# EAGLE design FreshBytes (EAGLE 9.1.0)
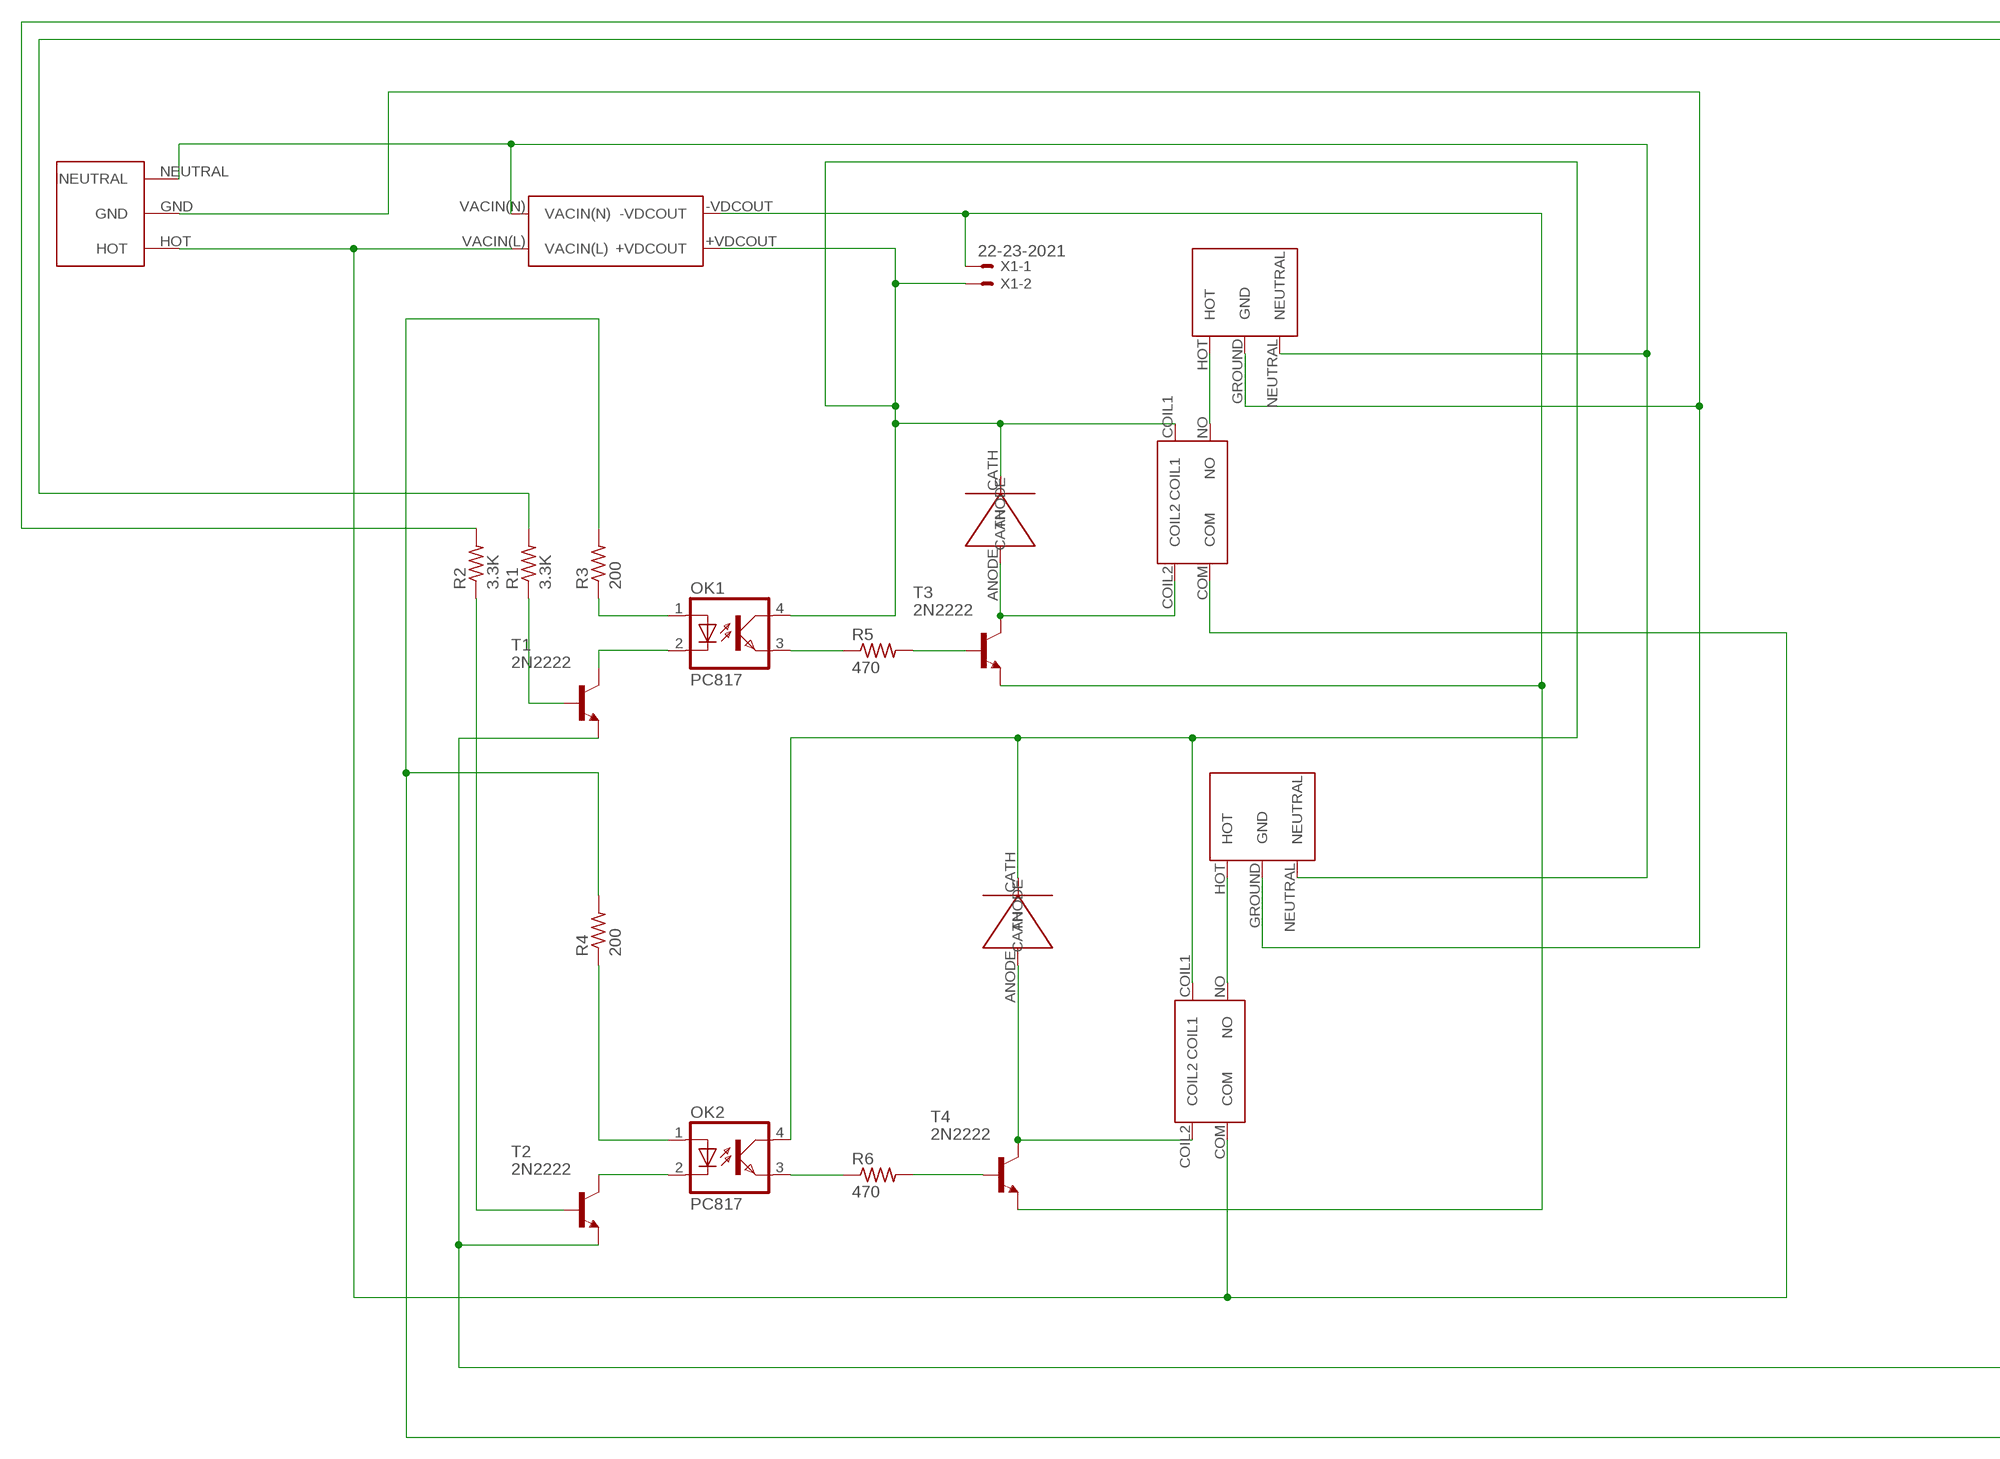
[diagram p0: schematic, sheet 1, part 1 of 2]
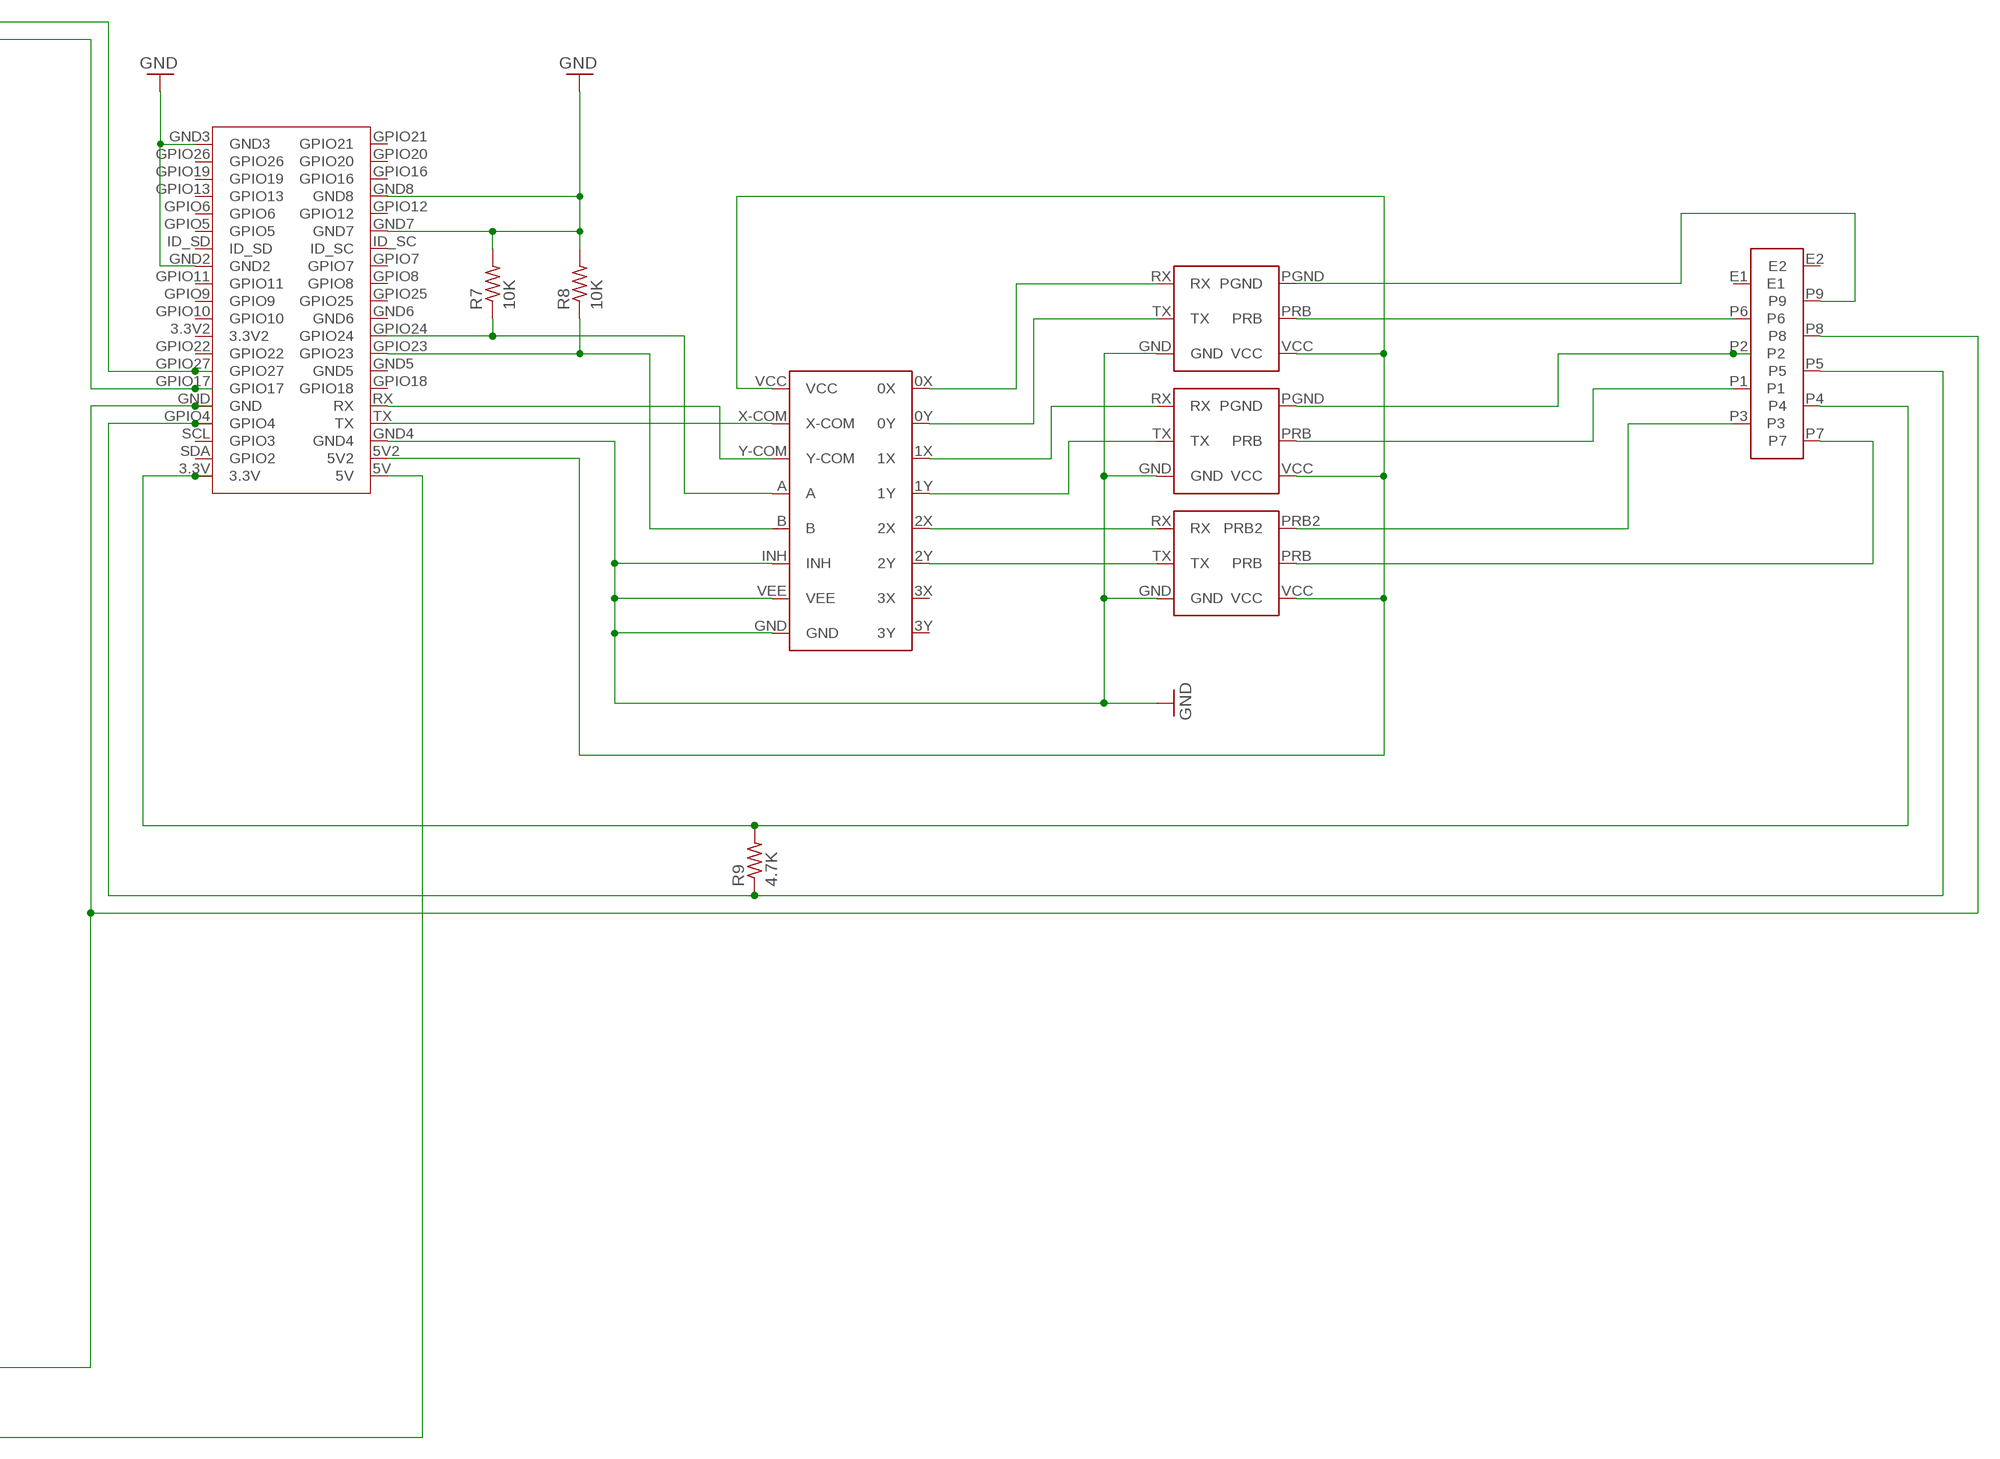
[diagram p1: schematic, sheet 1, part 2 of 2]

## Parts
MUX  7HC4052_MUX  [SSOP16]
OK1  PC817  [DIL04]
OK2  PC817  [DIL04]
R1  3.3K  R-US_R0805  [R0805]
R2  3.3K  R-US_R0805  [R0805]
R3  200  R-US_R0805  [R0805]
R4  200  R-US_R0805  [R0805]
R5  470  R-US_R0805  [R0805]
R6  470  R-US_R0805  [R0805]
R7  10K  R-US_R0805  [R0805]
R8  10K  R-US_R0805  [R0805]
R9  4.7K  R-US_R0805  [R0805]
T1  2N2222  [TO92-EBC-OVAL]
T2  2N2222  [TO92-EBC-OVAL]
T3  2N2222  [TO92-EBC-OVAL]
T4  2N2222  [TO92-EBC-OVAL]
U$1  POWER_IN  [POWER_IN]
U$2  VTB8441BH  [VTB8441BH]
U$3  VTB8441BH  [VTB8441BH]
U$4  9POS_MINI_DIN  [9POS_MINI_DIN]
U$5  ATLAS_DO_WITH_ICON  [ATLAS_DO_WITH_ICON]
U$6  IEC_FEMALE  [IEC_FEMALE]
U$7  IEC_FEMALE  [IEC_FEMALE]
U$8  ATLAS_PH_WITH_ICON  [ATLAS_PH_WITH_ICON]
U$9  ATLAS_PPM_WITH_ICON  [ATLAS_PPM_WITH_ICON]
U$10  RPI_ZERO  [RPI_ZERO]
U$11  RELAY  [RELAY]
U$12  RELAY  [RELAY]
U$17  RAC02-05SC_ACDCCONVERTER  [RAC02-05SC_ACDCCONVERTER]
X1  22-23-2021  [22-23-2021]

## Nets
AGND: T3.E T4.E U$17.-VDCOUT X1.1
DGND: T1.E T2.E U$4.P8 U$10.GND
GND: MUX.GND MUX.INH MUX.VEE R7.2 R8.2 U$5.GND U$8.GND U$9.GND U$10.GND2 U$10.GND3 U$10.GND4 U$10.GND7 U$10.GND8
N$1: R2.2 U$10.GPIO27
N$3: R1.1 T1.B
N$4: OK1.1(A) R3.1
N$5: OK1.2(C) T1.C
N$7: MUX.X-COM U$10.TX
N$8: R2.1 T2.B
N$9 [Power]: U$6.HOT U$11.NO
N$10: OK2.1(A) R4.1
N$11: OK2.2(C) T2.C
N$12: OK2.3(EMIT) R6.1
N$13: OK1.3(EMIT) R5.1
N$14: R5.2 T3.B
N$15: R6.2 T4.B
N$16: T4.C U$3.ANODE U$12.COIL2
N$17 [Power]: U$7.HOT U$12.NO
N$18: T3.C U$2.ANODE U$11.COIL2
N$19 [Power]: U$1.HOT U$11.COM U$12.COM U$17.VACIN(L)
N$20 [Power]: U$1.NEUTRAL U$6.NEUTRAL U$7.NEUTRAL U$17.VACIN(N)
N$21: MUX.Y-COM U$10.RX
N$22: MUX.2Y U$9.TX
N$23: MUX.2X U$9.RX
N$24: MUX.1Y U$8.TX
N$25: MUX.1X U$8.RX
N$26: MUX.0Y U$5.TX
N$27: MUX.0X U$5.RX
N$29: MUX.A R7.1 U$10.GPIO24
N$31: U$4.P9 U$5.PGND
N$32: OK1.4(COL) OK2.4(COL) U$2.CATH U$3.CATH U$11.COIL1 U$12.COIL1 U$17.+VDCOUT X1.2
N$33: MUX.VCC U$5.VCC U$8.VCC U$9.VCC U$10.5V2
N$35: R1.2 U$10.GPIO17
N$36: R9.2 U$4.P4 U$10.3.3V
N$37: U$4.P7 U$9.PRB
N$38: U$4.P3 U$9.PRB2
N$39: U$4.P1 U$8.PRB
N$40: U$4.P2 U$8.PGND
N$41: U$4.P6 U$5.PRB
N$42: R9.1 U$4.P5 U$10.GPIO4
N$43: MUX.B R8.1 U$10.GPIO23
N$44: R3.2 R4.2 U$10.5V
PGND [Power]: U$1.GND U$6.GROUND(GND) U$7.GROUND(GND)
Unconnected: MUX.3X MUX.3Y U$4.E1 U$4.E2 U$10.GND6 U$10.GPIO5 U$10.GPIO6 U$10.GPIO7 U$10.GPIO8 U$10.GPIO9 U$10.GPIO10 U$10.GPIO11 U$10.GPIO12 U$10.GPIO13 U$10.GPIO16 U$10.GPIO18 U$10.GPIO19 U$10.GPIO20 U$10.GPIO21 U$10.GPIO22 U$10.GPIO25 U$10.GPIO26 U$10.ID_SC U$10.ID_SD U$10.SCL(GPIO3) U$10.SDA(GPIO2)

## Power pins joined to a net without a drawn wire
3.3V2: U$10.3.3V2
GND5: U$10.GND5

## Library data of the parts
MUX = BloomWall:7HC4052_MUX
OK1 OK2 = optocoupler:PC817: SHARP OPTO COUPLER; MPN: PC817X4J000F; OC_FARNELL: 9707727; OC_NEWARK: 97K7059
R1-R6 = resistor:R-US_: RESISTOR, American symbol
R7-R9 = adafruit:R-US_: RESISTOR, American symbol
T1-T4 = adafruit:2N2222: NPN TRANSISTOR Big oval pads
U$1 = FreshBytes:POWER_IN
U$2 U$3 = BloomWall:VTB8441BH
U$4 = BloomWall:9POS_MINI_DIN
U$5 = BloomWall:ATLAS_DO_WITH_ICON
U$6 U$7 = BloomWall:IEC_FEMALE
U$8 = BloomWall:ATLAS_PH_WITH_ICON
U$9 = BloomWall:ATLAS_PPM_WITH_ICON
U$10 = FreshBytes:RPI_ZERO
U$11 U$12 = FreshBytes:RELAY
U$17 = BloomWall:RAC02-05SC_ACDCCONVERTER
X1 = con-molex:22-23-2021: .100" (2.54mm) Center Header - 2 Pin; MF: MOLEX; MPN: 22-23-2021; OC_FARNELL: 1462926; OC_NEWARK: 25C3832

## Net classes
0 default: width 0.305 mm, drill 0.508 mm, clearance 0.203 mm
1 Power: width 5.715 mm, drill 5.715 mm, clearance 0.508 mm

## Board
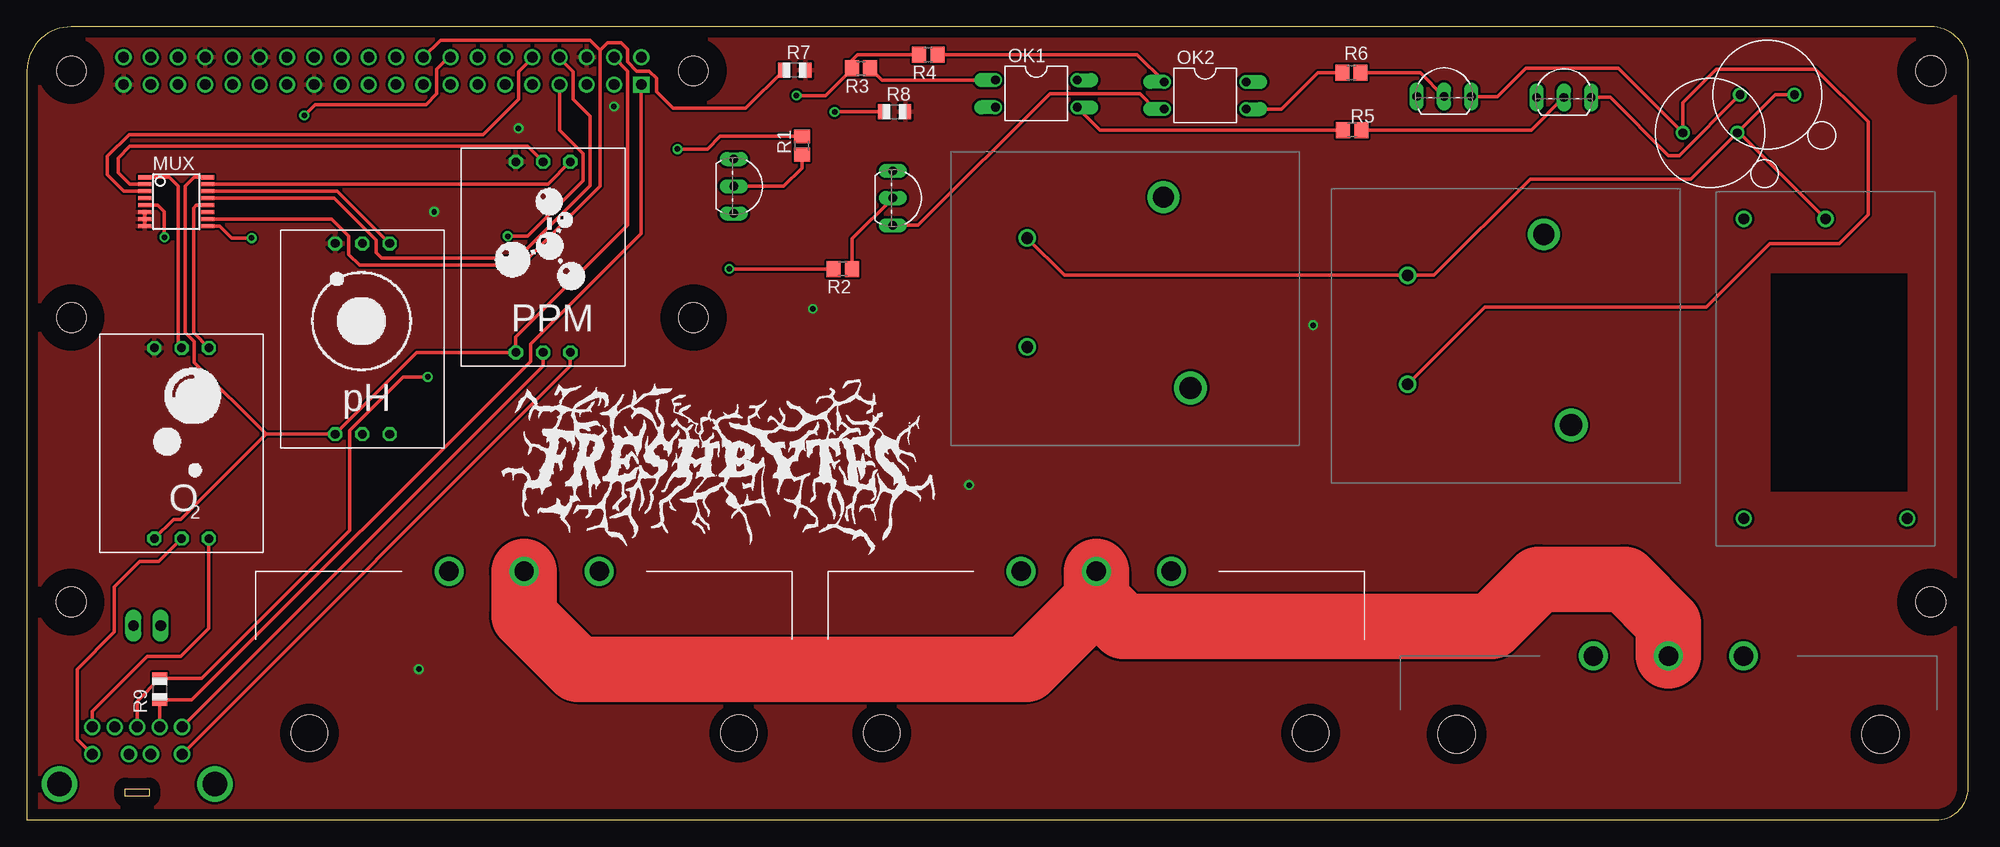
[diagram p2: board, top side]
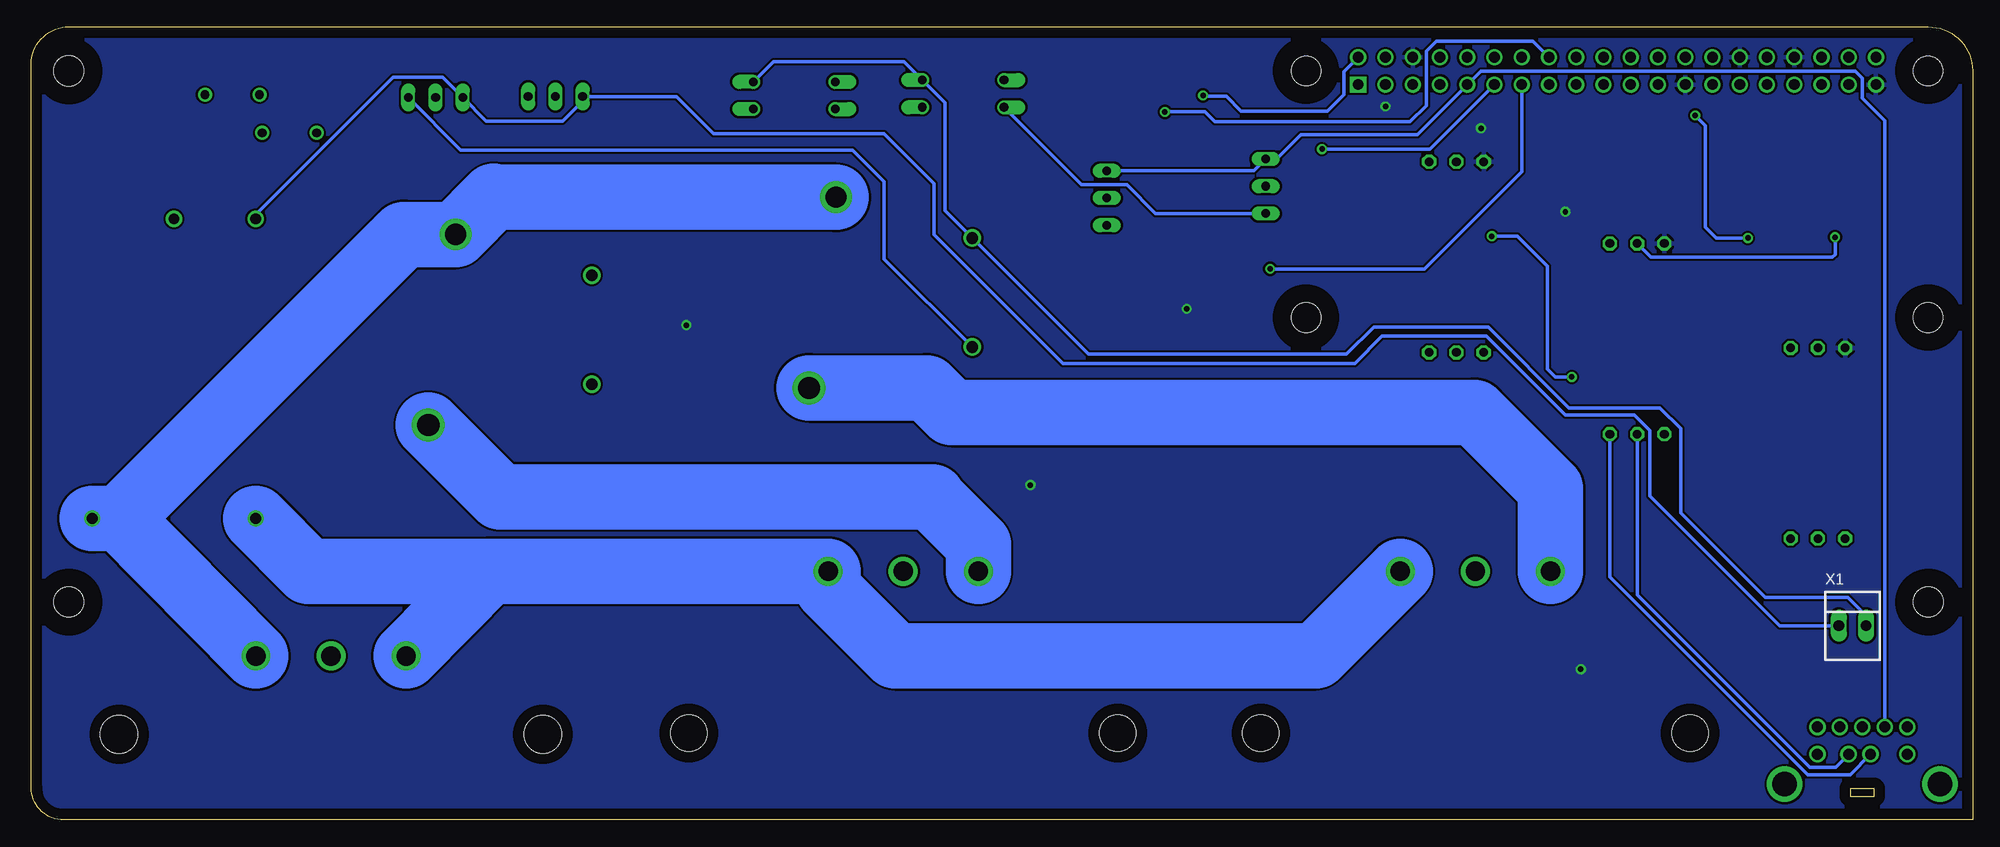
[diagram p3: board, bottom side, seen from below]

Size 180.97 x 73.96 mm. Coordinates in mm from the lower left corner, seen from the top.
Outline: 0,0 177.97,0 arc90 180.97,3 180.97,70.48 arc90 177.47,73.97 4.14,73.97 arc90 0,69.85 0,0
Copper layers (1*16): Top 0.035mm / dielectric 1.5mm / Bottom 0.035mm
Design rules "default *": minimum track width 10mil, minimum drill 12mil, track to track 8mil, track to pad 8mil, pad to pad 8mil, via to via 8mil, smd to smd 8mil, copper to edge 40mil, drill to drill 8mil, minimum pad ring 10mil, minimum via ring 8mil, stop-mask expansion 4mil, vias tented up to drill 0mil, thermal gap 10mil
Holes 2.8 mm at 4.13,20.32 177.48,69.85 177.48,20.32
tRestrict: area 175.9,18.8 to 179,21.9; area 175.9,68.3 to 179,71.4; area 2.6,18.8 to 5.7,21.9
bRestrict: area 2.6,18.8 to 5.7,21.9; area 175.9,68.3 to 179,71.4; area 175.9,18.8 to 179,21.9

### Footprints (pad centres in the part's own frame; a part is rotated, then mirrored left to right if it is on the bottom)
SSOP16 = smd 0.4 x 1.2: 0X 0.325,2.925; 0Y -2.275,-2.925; 1X -0.975,2.925; 1Y 0.325,-2.925; 2X -1.625,2.925; 2Y -1.625,-2.925; 3X 0.975,2.925; 3Y -0.325,-2.925; A 1.625,2.925; B 2.275,2.925; GND 2.275,-2.925; INH 0.975,-2.925; VCC -2.275,2.925; VEE 1.625,-2.925; X-COM -0.325,2.925; Y-COM -0.975,-2.925
DIL04 = drill 0.813 offset: 1 -1.27,-3.81; 2 1.27,-3.81; 3 1.27,3.81; 4 -1.27,3.81
R0805 = smd 1.3 x 1.5: 1 -0.85,0; 2 0.85,0
R0805' = smd 1.1 x 1.4: 1 -1,0; 2 1,0
TO92-EBC-OVAL = drill 0.813 long: B 0,-1.27; C 2.54,-1.27; E -2.54,-1.27
POWER_IN = drill 1.8: GND 0,0; HOT 7,0; NEUTRAL -7,0 | hole 3.5: -19.75,-7.3; 19.75,-7.3
VTB8441BH = drill 0.8: ANODE 2.54,0; CATH -2.54,0
9POS_MINI_DIN = drill 2.286: E1 -7.239,-5.588; E2 7.239,-5.588 | drill 1.016: P1 -1.27,-8.382; P2 0.762,-8.382; P3 -4.191,-8.382; P4 -2.095,-10.922; P5 0,-10.922; P6 4.191,-8.382; P7 -4.191,-10.922; P8 2.095,-10.922; P9 4.191,-10.922
ATLAS_DO_WITH_ICON = drill 0.8 octagon: GND -2.54,8.89; PGND 2.54,-8.89; PRB 0,-8.89; RX 2.54,8.89; TX 0,8.89; VCC -2.54,-8.89
IEC_FEMALE = drill 1.803: GROUND 0,0; HOT -7,0; NEUTRAL 7,0 | hole 3.404: -20,-15.1; 20,-15.1
ATLAS_PH_WITH_ICON = drill 0.8 octagon: GND -2.54,8.89; PGND 2.54,-8.89; PRB 0,-8.89; RX 2.54,8.89; TX 0,8.89; VCC -2.54,-8.89
ATLAS_PPM_WITH_ICON = drill 0.8 octagon: GND -2.54,8.89; PRB 0,-8.89; PRB2 2.54,-8.89; RX 2.54,8.89; TX 0,8.89; VCC -2.54,-8.89
RPI_ZERO = drill 1 square: 3.3V 24.13,-1.27 | drill 1: 3.3V2 3.81,-1.27; 5V 24.13,1.27; 5V2 21.59,1.27; GND 13.97,-1.27; GND2 -6.35,-1.27; GND3 -24.13,-1.27; GND4 19.05,1.27; GND5 8.89,1.27; GND6 1.27,1.27; GND7 -11.43,1.27; GND8 -16.51,1.27; GPIO4 16.51,-1.27; GPIO5 -11.43,-1.27; GPIO6 -13.97,-1.27; GPIO7 -6.35,1.27; GPIO8 -3.81,1.27; GPIO9 -1.27,-1.27; GPIO10 1.27,-1.27; GPIO11 -3.81,-1.27; GPIO12 -13.97,1.27; GPIO13 -16.51,-1.27; GPIO16 -19.05,1.27; GPIO17 11.43,-1.27; GPIO18 11.43,1.27; GPIO19 -19.05,-1.27; GPIO20 -21.59,1.27; GPIO21 -24.13,1.27; GPIO22 6.35,-1.27; GPIO23 6.35,1.27; GPIO24 3.81,1.27; GPIO25 -1.27,1.27; GPIO26 -21.59,-1.27; GPIO27 8.89,-1.27; ID_SC -8.89,1.27; ID_SD -8.89,-1.27; RX 13.97,1.27; SCL 19.05,-1.27; SDA 21.59,-1.27; TX 16.51,1.27 | hole 2.75: -29,0; -29,-23; 29,0; 29,-23
RELAY = drill 1.092: COIL1 -13.97,-15.24; COIL2 -3.81,-15.24 | drill 1.981: COM -17.78,-2.54 | drill 2.057: NO 0,0
RAC02-05SC_ACDCCONVERTER = drill 1: +VDCOUT 0,0; -VDCOUT 0,7.62; VACIN(L) -27.94,-7.62; VACIN(N) -27.94,7.62
22-23-2021 = drill 1 long: 1 -1.27,0; 2 1.27,0

### Placement (x,y rotation side)
MUX  13.93,57.66 270 top
OK1  94.1,67.74 270 top
OK2  109.85,67.56 270 top
R1  72.25,62.89 90 top
R2  76.07,51.38 180 top
R3  77.77,70.09 180 top
R4  84.03,71.36 180 top
R5  123.56,64.33 0 top
R6  123.48,69.68 0 top
R7  10K  [R0805']  71.58,69.94 0 top
R8  10K  [R0805']  80.89,66.04 0 top
R9  4.7K  [R0805']  12.4,12.19 270 top
T1  67.18,59.1 270 top
T2  82,58 270 top
T3  143.29,68.65 0 top
T4  132.12,68.73 0 top
U$1  153.03,15.29 0 top
U$2  162.25,67.63 180 top
U$3  156.91,64.08 180 top
U$4  10.29,-2.25 180 top
U$5  14.43,35.13 0 top
U$6  46.35,23.2 0 top
U$7  99.7,23.2 0 top
U$8  31.28,44.87 0 top
U$9  48.13,52.49 0 top
U$10  33.15,69.85 0 top
U$11  108.49,40.3 270 top
U$12  143.96,36.83 270 top
U$17  167.68,56.05 90 top
X1  11.21,18.12 0 bottom

### Tracks (layer width: path | path; a pad name or v marks a point on that pad's centre or on a via)
AGND
  Bottom 0.305: X1.1 17.99,18.12 30.1,30.22 30.1,36.32 31.54,37.76 37.97,37.76 45.34,45.12 55.07,45.12 57.61,42.58 84.79,42.58 96.81,54.6 96.81,59.34 101.46,64 105.95,64 | 105.95,64 117.38,64 120.84,67.46 T4.E 129.58,67.04 131.43,65.19 138.56,65.19 T3.E 142.62,69.25 147.26,69.25 160.06,56.46 U$17.-VDCOUT | 105.95,64 | 105.95,64
DGND
  Bottom 0.305: U$4.P8 8.19,65.21 10.29,67.3 10.29,69.17 10.96,69.84 45.85,69.84 U$10.GND 51.78,63.92 62.6,63.92 64.88,61.64 T1.E 67.01,60.54 T2.E
GND  (via drill 0.51)
  Top 0.305: MUX.INH MUX.VEE MUX.GND
  other vias: 36.53,14.05 37.97,56.72 119.92,46.14 87.83,31.24 73.27,47.66 45.84,64.51 54.73,66.54
  pour Top: -2.07,76.2 186.72,76.2 186.72,-3.89 -2.07,-3.89
  pour Bottom: -3.17,76.2 183.67,76.2 183.67,-5.25 -3.17,-5.25
N$1  (via drill 0.51)
  Top 0.305: v65.48,51.39 R2.2
  Bottom 0.305: U$10.GPIO27 42.04,60.44 51.09,51.39 v65.48,51.39
N$3
  Top 0.305: R1.1 72.25,60.78 70.56,59.09 70.55,59.1 T1.B
N$4
  Top 0.305: OK1.1 79.7,69 R3.1
N$5
  Bottom 0.305: T1.C 76.16,56.56 78.86,59.26 83.09,59.26 OK1.2
N$7
  Top 0.305: MUX.X-COM 28.66,57.99 32.55,54.1 32.55,52.91 33.06,52.4 45.76,52.4 52.53,59.18 52.53,65.61 50.92,67.22 50.92,69.76 49.66,71.02 U$10.TX
N$8
  Top 0.305: R2.1 76.92,54.2 T2.B
N$9
  Bottom 6.096: U$11.NO 97.48,40.3 95.2,38.01 46.43,38.01 39.35,30.93 U$6.HOT
N$10
  Top 0.305: OK2.1 103.51,71.37 103.5,71.36 R4.1
N$11
  Top 0.305: T2.C 83.1,55.46 95.37,67.73 103.75,67.73 105.19,66.29 OK2.2
N$12
  Top 0.305: R6.1 120.35,69.68 116.95,66.29 113.67,66.29 OK2.3
N$13
  Top 0.305: R5.1 100.05,64.33 OK1.3
N$14
  Top 0.305: R5.2 140.24,64.33 T3.B
N$15
  Top 0.305: R6.2 129.9,69.68 T4.B
N$16
  Top 0.305: T4.C 137.1,67.46 139.73,70.1 148.35,70.1 U$3.ANODE 154.37,66.88 157.51,70.01 166.73,70.01 171.64,65.1 171.64,56.47 168.94,53.76 162.5,53.76 156.57,47.83 147.18,47.83 135.92,47.83 U$12.COIL2
N$17
  Bottom 6.096: U$7.HOT 92.7,25.69 96.98,29.97 96.98,30.14 137.27,30.14 U$12.NO
N$18
  Top 0.305: T3.C 147.61,67.38 153.02,61.97 154.04,61.97 U$2.ANODE
  Bottom 0.305: U$11.COIL2 101.46,52.32 101.46,59.52 104.43,62.48 140.93,62.48 T3.C
N$19
  Bottom 6.096: U$1.HOT 172.75,28.11 | 172.75,28.11 U$17.VACIN(L) | 172.75,28.11 146.26,54.61 U$12.COM 137.87,58.16 137.78,58.08 U$11.COM
N$20
  Bottom 6.096: 138.23,23.2 U$7.NEUTRAL 106.7,21.57 100.45,15.32 61.23,15.32 U$6.NEUTRAL | 138.23,23.2 U$1.NEUTRAL | U$17.VACIN(N) 155.15,23.2 138.23,23.2
N$21
  Top 0.305: MUX.Y-COM 9.05,58.64 7.49,60.19 7.49,61.88 9.52,63.92 42.54,63.92 45.84,67.22 45.84,69.76 47.12,71.03 U$10.RX
N$22
  Top 0.305: MUX.2Y 9.58,59.29 8.51,60.36 8.51,61.72 9.61,62.82 46.69,62.82 U$9.TX
N$23
  Top 0.305: MUX.2X 48.58,59.29 U$9.RX
N$24  (via drill 0.51)
  Top 0.305: MUX.1Y 12.21,57.34 12.83,56.72 v12.83,54.35
  Bottom 0.305: v12.83,54.35 12.83,52.74 13.08,52.49 30.01,52.49 U$8.TX
N$25
  Top 0.305: MUX.1X 28.95,58.64 U$8.RX
N$26
  Top 0.305: MUX.0Y 13.25,59.94 14.1,59.09 14.1,44.36 U$5.TX
N$27
  Top 0.305: MUX.0X 15.81,57.34 15.54,57.06 15.54,45.46 U$5.RX
N$29
  Top 0.305: MUX.A 28.41,56.04 30.01,54.44 30.01,52.74 31.03,51.73 46.1,51.73 53.46,59.09 53.46,71.79 | 53.46,71.79 52.53,72.72 38.56,72.72 U$10.GPIO24 | 53.46,71.79 54.14,72.47 55.41,72.47 56,71.88 56,70.69 56.85,69.84 58.02,69.84 58.71,69.16 58.71,67.9 60.23,66.37 67.01,66.37 70.57,69.94 R7.1
N$31
  Top 0.305: U$4.P9 6.1,10.12 11.22,15.24 14.35,15.24 16.97,17.86 U$5.PGND
N$32
  Top 0.305: U$2.CATH 163.01,67.64 U$3.CATH | U$17.+VDCOUT 159.65,64.08 U$3.CATH | U$3.CATH 155.14,59.77 140.15,59.77 131.18,50.8 U$12.COIL1 96.72,50.8 U$11.COIL1
  Bottom 0.305: X1.2 9.94,19.04 11.64,20.74 19.34,20.74 27.22,28.61 27.22,36.49 29.17,38.44 37.63,38.44 45.16,45.97 55.83,45.97 58.37,43.43 82.41,43.43 U$11.COIL1 95.79,56.81 95.79,66.88 OK1.4 99.6,70.69 111.8,70.69 OK2.4
N$33
  Top 0.305: 16.89,59.97 MUX.VCC 15.62,59.94 14.77,59.09 14.77,45.46 15.62,44.62 15.62,42.67 22.31,35.98 | 22.31,35.98 U$8.VCC 36.36,43.6 U$9.VCC | U$9.VCC | U$9.VCC 45.59,45.04 56,55.45 56,69.84 54.74,71.11 U$10.5V2 | 22.31,35.98 14.35,28.02 13.67,28.02 U$5.VCC
N$35  (via drill 0.51)
  Top 0.305: v60.66,62.56 63.45,62.56 64.64,63.75 R1.2
  Bottom 0.305: U$10.GPIO17 50.59,62.56 v60.66,62.56
N$36
  Top 0.305: U$4.P4 12.38,11.17 R9.2 15.38,11.19 46.94,42.75 46.94,44.36 57.28,54.7 U$10.3.3V
N$37
  Top 0.305: U$4.P7 48.13,42.32 U$9.PRB
N$38
  Top 0.305: U$4.P3 50.67,42.32 U$9.PRB2
N$39
  Bottom 0.305: U$4.P1 12.78,4.91 15.2,4.91 31.28,21 U$8.PRB
N$40
  Bottom 0.305: U$4.P2 11.42,4.23 15.37,4.23 33.82,22.69 U$8.PGND
N$41
  Top 0.305: U$4.P6 4.7,7.53 4.7,14.05 8.17,17.52 8.17,21.76 10.46,24.04 | 10.46,24.04 | 10.46,24.04 10.54,24.13 12.32,24.13 U$5.PRB
N$42  (via drill 0.51)
  Top 0.305: U$4.P5 10.29,11.08 R9.1 16.28,13.19 16.81,13.71 30.1,27.01 30.1,36.32 35.09,41.31 v37.38,41.31 | U$10.GPIO4 49.66,64.33 51.85,62.14 51.85,59.6 46.69,54.44 v44.83,54.44
  Bottom 0.305: v44.83,54.44 42.46,54.44 39.66,51.64 39.66,42.08 38.9,41.31 v37.38,41.31
N$43  (via drill 0.51)
  Top 0.305: MUX.B 17.97,55.39 19.09,54.27 v20.95,54.27 | v25.86,65.69 26.88,66.71 37.21,66.71 38.22,67.73 38.22,70.01 39.33,71.12 U$10.GPIO23 | R8.1 v75.3,66.03
  Bottom 0.305: v20.95,54.27 23.92,54.27 24.93,55.28 24.93,64.76 v25.86,65.69 | U$10.GPIO23 41.01,72.64 49.99,72.64 50.92,71.7 | 50.92,71.7 | 50.92,71.7 50.92,66.63 52.45,65.1 70.65,65.1 71.58,66.03 v75.3,66.03
N$44  (via drill 0.51)
  Top 0.305: v71.75,67.56 74.46,67.56 76.92,70.02 R3.2 76.92,70.86 77.42,71.37 R4.2
  Bottom 0.305: U$10.5V 58.63,69.77 58.63,67.64 60.15,66.12 68.19,66.12 69.55,67.47 71.66,67.47 v71.75,67.56
PGND
  Top 6.096: U$7.GROUND 99.7,20.56 | 99.7,20.56 102.23,18.03 136.51,18.03 140.91,22.43 148.96,22.43 153.03,18.36 U$1.GND | U$6.GROUND 46.35,19.04 51.34,14.05 93.19,14.05 99.7,20.56